# Altium schematic sheet Motor_Board.SchDoc
size A4; DrawnBy: Mike Cusdin; Organization: University of Canterbury; Address1: Electrical & Computer Eng; Address2: Private Bag 4800; Address3: Christchurch 8020; Address4: New Zealand; Revision: 2.0
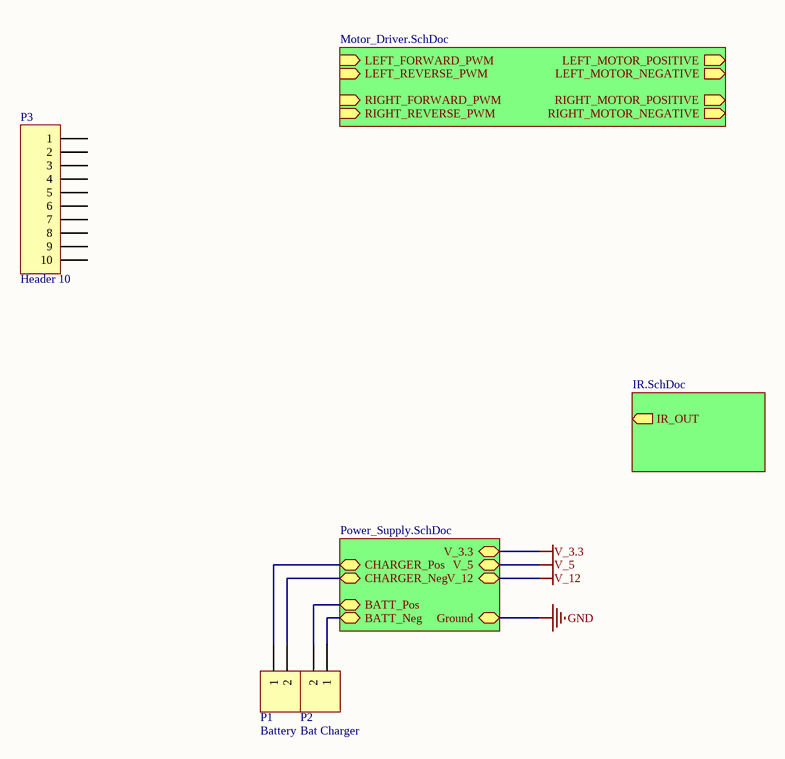
[diagram p0: Motor_Board.SchDoc]

## Parts
P1  Battery  [TMHDR2]
P2  Bat Charger  [DC1.6]
P3  Header 10  [HDR1X10]

## Sub-sheets
? = Power_Supply.SchDoc: BATT_Pos, CHARGER_Neg, CHARGER_Pos, BATT_Neg, V_5, Ground, V_3.3, V_12
? = Motor_Driver.SchDoc: LEFT_FORWARD_PWM (in), RIGHT_FORWARD_PWM (in), LEFT_MOTOR_POSITIVE (out), RIGHT_MOTOR_POSITIVE (out), RIGHT_REVERSE_PWM (in), LEFT_REVERSE_PWM (in), RIGHT_MOTOR_NEGATIVE (out), LEFT_MOTOR_NEGATIVE (out)
? = IR.SchDoc: IR_OUT (out)

## Nets
GND: sheet /Ground
V_3.3: sheet /V_3.3
V_5: sheet /V_5
V_12: sheet /V_12
NetP1_1: P1.1 ; sheet /CHARGER_Pos
NetP1_2: P1.2 ; sheet /CHARGER_Neg
NetP2_1: P2.1 ; sheet /BATT_Neg
NetP2_2: P2.2 ; sheet /BATT_Pos

Not connected (* = marked no-connect by the designer): P3 1 2 3 4 5 6 7 8 9 10

## Notes on the sheet
- Title
- Size:
- Date:
- A4
- Number:
- Time:
- Revision:
- Sheet
- of
- File:

## Library data of the parts
P1 = MHDR1X2: Header, 2-Pin; LatestRevisionDate: 17-Jul-2002; LatestRevisionNote: Re-released for DXP Platform.; Publisher: Altium Limited
P2 = Header 2: Header, 2-Pin; LatestRevisionDate: 17-Jul-2002; LatestRevisionNote: Re-released for DXP Platform.; Publisher: Altium Limited
P3 = Header 10: Header, 10-Pin; LatestRevisionDate: 17-Jul-2002; LatestRevisionNote: Re-released for DXP Platform.; Publisher: Altium Limited